# EAGLE design Satshakit_Crab (EAGLE 8.0.1)
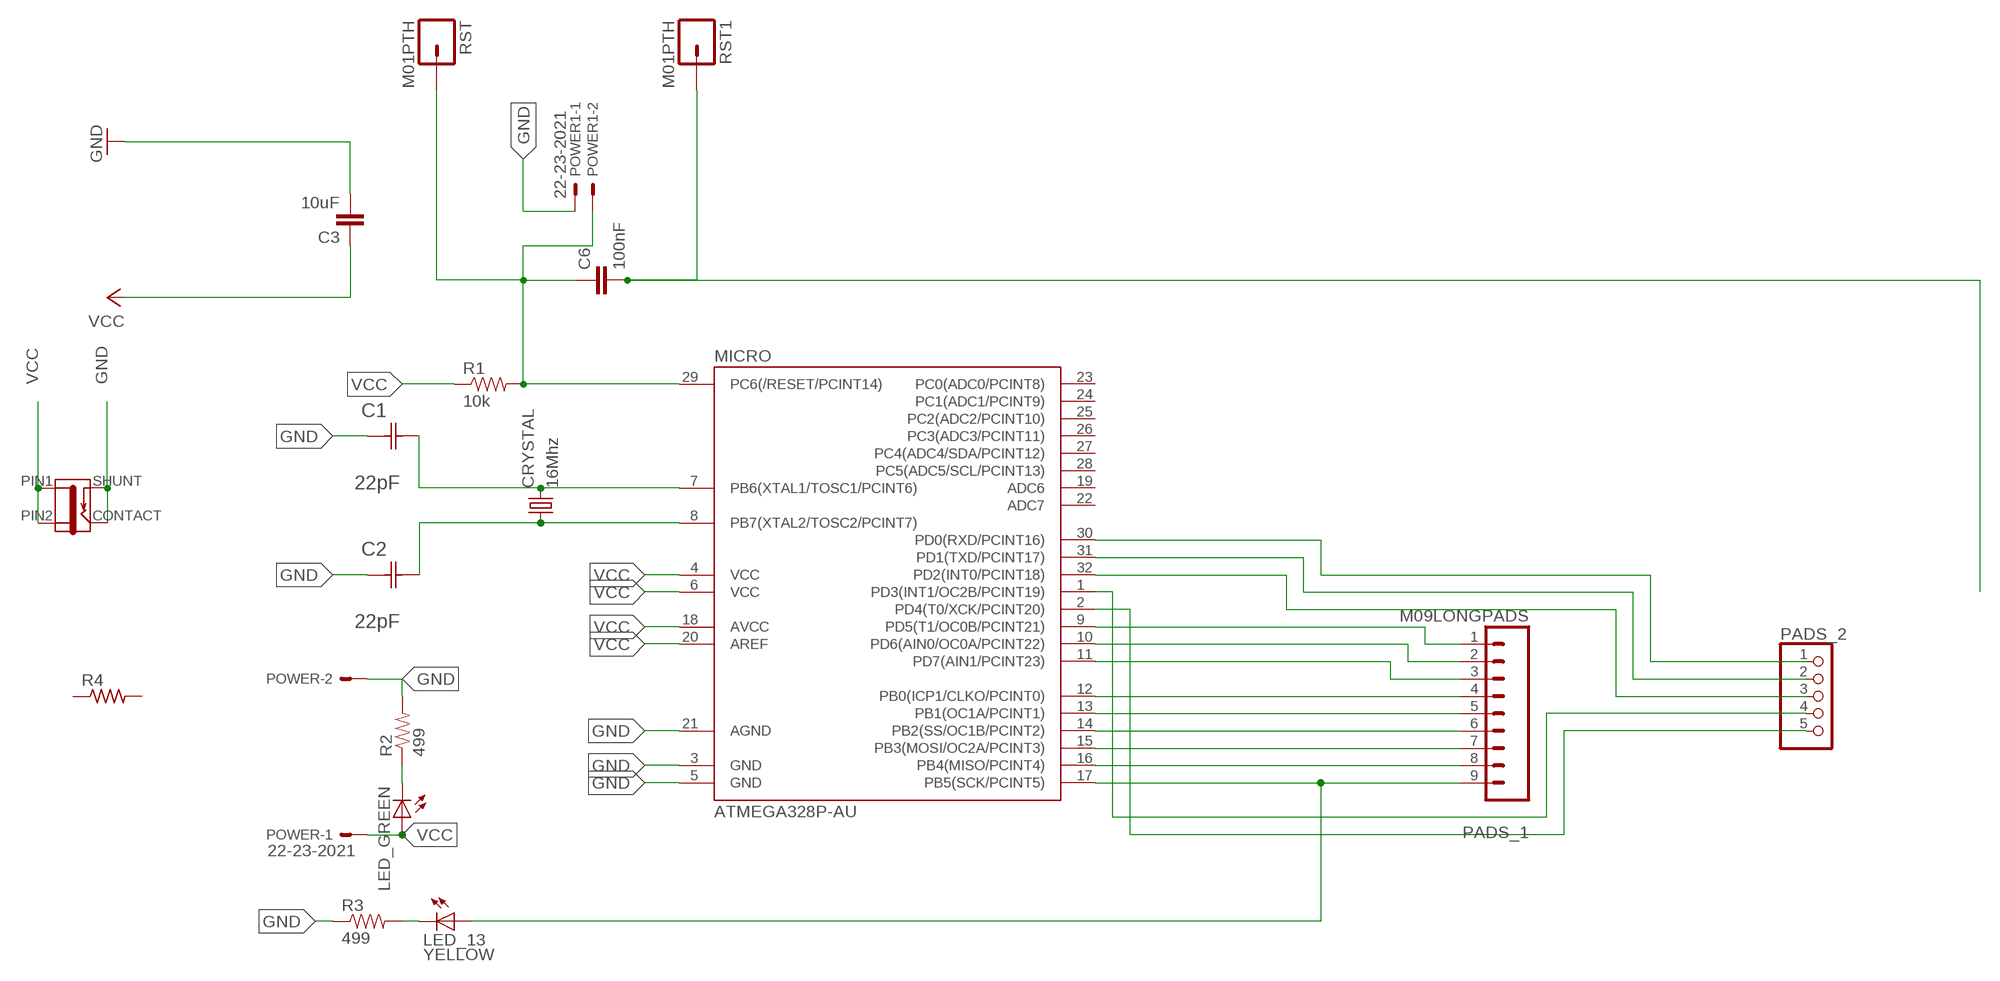
[diagram p0: schematic, sheet 1]

## Parts
C1  22pF  0612ZC225MAT2A  [CAPC3216X178N]
C2  22pF  0612ZC225MAT2A  [CAPC3216X178N]
C3  10uF  CAP1206  [1206]
C6  100nF  CAP1206  [1206]
CRYSTAL  16Mhz  CSM-7X-DU  [CSM-7X-DU]
J1  JACK-2.1MM  [PJ-002AH-SMT]
LED_13  YELLOW  LED1206  [1206]
LED_GREEN  LED1206  [1206]
MICRO  ATMEGA328P-AU  ATMEGA48/88/168-AU  [TQFP32-08]
PADS_1  M09LONGPADS  [1X09_LONGPADS]
PADS_2  PINHD-1X5  [1X05]
POWER  22-23-2021  [22-23-2021]
POWER1  22-23-2021  [22-23-2021]
R1  10k  RESISTOR1206  [1206]
R2  499  RESISTOR1206  [1206]
R3  499  RESISTOR1206  [1206]
R4  RES-US1206FAB  [R1206FAB]
RST  M01PTH  [1X01]
RST1  M01PTH  [1X01]

## Nets
GND: C1.1(C1) C2.1(C1) C3.2 J1.CONTACT J1.SHUNT MICRO.3(GND) MICRO.5(GND) MICRO.21(AGND) POWER1.1 POWER.2 R2.2 R3.1
N$1: MICRO.9(PD5(T1/OC0B/PCINT21)) PADS_1.1
N$2: C1.2(C2) CRYSTAL.2 MICRO.7(PB6(XTAL1/TOSC1/PCINT6))
N$3: C6.2 RST1.1
N$4: MICRO.10(PD6(AIN0/OC0A/PCINT22)) PADS_1.2
N$5: MICRO.11(PD7(AIN1/PCINT23)) PADS_1.3
N$6: MICRO.12(PB0(ICP1/CLKO/PCINT0)) PADS_1.4
N$7: MICRO.13(PB1(OC1A/PCINT1)) PADS_1.5
N$8: MICRO.14(PB2(SS/OC1B/PCINT2)) PADS_1.6
N$9: C2.2(C2) CRYSTAL.1 MICRO.8(PB7(XTAL2/TOSC2/PCINT7))
N$10: MICRO.15(PB3(MOSI/OC2A/PCINT3)) PADS_1.7
N$11: MICRO.16(PB4(MISO/PCINT4)) PADS_1.8
N$12: LED_13.1(A) MICRO.17(PB5(SCK/PCINT5)) PADS_1.9
N$20: MICRO.30(PD0(RXD/PCINT16)) PADS_2.1
N$21: MICRO.31(PD1(TXD/PCINT17)) PADS_2.2
N$22: MICRO.32(PD2(INT0/PCINT18)) PADS_2.3
N$23: MICRO.1(PD3(INT1/OC2B/PCINT19)) PADS_2.4
N$24: MICRO.2(PD4(T0/XCK/PCINT20)) PADS_2.5
N$26: LED_GREEN.2(C) R2.1
N$27: LED_13.2(C) R3.2
N$28: C6.1 MICRO.29(PC6(/RESET/PCINT14)) POWER1.2 R1.2 RST.1
VCC: C3.1 J1.PIN1 J1.PIN2 LED_GREEN.1(A) MICRO.4(VCC) MICRO.6(VCC) MICRO.18(AVCC) MICRO.20(AREF) POWER.1 R1.1
Unconnected: MICRO.19(ADC6) MICRO.22(ADC7) MICRO.23(PC0(ADC0/PCINT8)) MICRO.24(PC1(ADC1/PCINT9)) MICRO.25(PC2(ADC2/PCINT10)) MICRO.26(PC3(ADC3/PCINT11)) MICRO.27(PC4(ADC4/SDA/PCINT12)) MICRO.28(PC5(ADC5/SCL/PCINT13)) R4.1 R4.2

## Library data of the parts
C1 C2 = AVX_By_element14_Batch_1:0612ZC225MAT2A: Capacitor 1206; MPN: 0612ZC225MAT2A; OC_FARNELL: -; OC_NEWARK: 12N3209; SUPPLIER: AVX; TOLERANCE: ±20%; VALUE: 2.2µF; VOLTAGERATING: 10V
C3 C6 = 01_SparkFun:CAP: Capacitor Standard 0603 ceramic capacitor, and 0.1" leaded capacitor.
CRYSTAL = 01_FAB_Hello:CSM-7X-DU: SMD CRYSTAL Source: www.ecsxtal.com .. Crystal 3.6864MHz CSM_7X_DU.PDF; OC_FARNELL: unknown; OC_NEWARK: unknown
J1 = fab:JACK-2.1MM: SMD DC power jack PJ-002AH-SMT As found in the fablab inventory. Made by Zaerc.
LED_13 LED_GREEN = 01_FAB_Hello:LED
MICRO = atmega8:ATMEGA48/88/168
PADS_1 = 01_SparkFun:M09: Header 9 Standard 9-pin 0.1" header. Use with straight break away headers (SKU : PRT-00116), right angle break away headers (PRT-00553), swiss pins (PRT-00743), machine pins (PRT-00117), and female headers (PRT-00115).
PADS_2 = pinhead:PINHD-1X5: PIN HEADER
POWER POWER1 = con-molex:22-23-2021: .100" (2.54mm) Center Header - 2 Pin; MF: MOLEX; MPN: 22-23-2021; OC_FARNELL: 1462926; OC_NEWARK: 25C3832
R1-R3 = 01_SparkFun:RESISTOR: Resistor Basic schematic elements and footprints for 0603, 1206, and PTH 1/10th watt (small) resistors.
R4 = fab:RES-US: Resistor (US Symbol) Variants with postfix FAB are widened to allow the routing of internal traces
RST RST1 = 01_SparkFun:M01: Header 1 Standard 1-pin 0.1" header. Use with straight break away headers (SKU : PRT-00116), right angle break away headers (PRT-00553), swiss pins (PRT-00743), machine pins (PRT-00117), and female headers (PRT-00115).

## Board
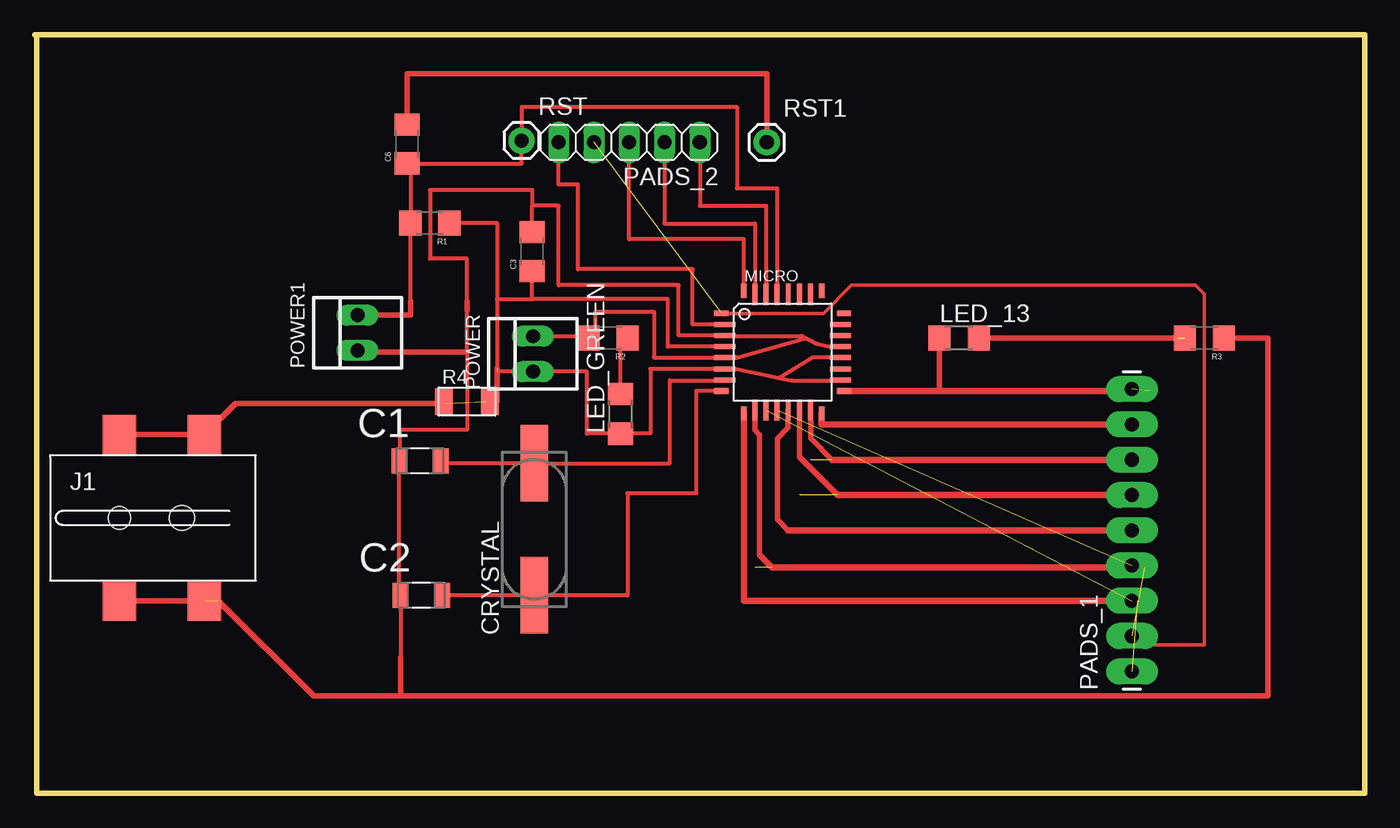
[diagram p1: board, top side]

Size 95.76 x 54.61 mm. Coordinates in mm from the lower left corner, seen from the top.
Outline: 0.13,54.61 0.13,0 95.76,0 95.76,54.61 0,54.61
Copper layers (1*16): Top 0.035mm / dielectric 1.5mm / Bottom 0.035mm
Design rules "default *": minimum track width 12mil, minimum drill 24mil, track to track 16mil, track to pad 16mil, pad to pad 16mil, via to via 16mil, smd to smd 16mil, copper to edge 40mil, drill to drill 8mil, minimum pad ring 10mil, minimum via ring 8mil, stop-mask expansion 4mil, vias tented up to drill 0mil, thermal gap 10mil

### Footprints (pad centres in the part's own frame; a part is rotated, then mirrored left to right if it is on the bottom)
CAPC3216X178N = smd 1.118 x 1.803: 1 -1.499,0; 2 1.499,0
1206 = smd 1.6 x 1.8: 1 -1.4,0; 2 1.4,0
CSM-7X-DU = smd 5.5 x 2: 1 -4.75,0; 2 4.75,0
PJ-002AH-SMT = smd 2.4 x 2.8: CONTACT -2.4,-6; PIN1 3.7,6; PIN2 -2.4,6; SHUNT 3.7,-6 | hole 1.6: -2.4,0 | hole 1.8: 2.1,0
1206' = smd 1.6 x 1.803: 1 -1.422,0; 2 1.422,0
TQFP32-08 = smd 1.016 x 0.406: 1 -4.42,2.8; 8 -4.42,-2.8; 17 4.42,-2.8; 24 4.42,2.8 | smd 1.524 x 0.356: 2 -4.166,2; 3 -4.166,1.2; 4 -4.166,0.4; 5 -4.166,-0.4; 6 -4.166,-1.2; 7 -4.166,-2; 18 4.166,-2; 19 4.166,-1.2; 20 4.166,-0.4; 21 4.166,0.4; 22 4.166,1.2; 23 4.166,2 | smd 0.406 x 1.016: 9 -2.8,-4.42; 16 2.8,-4.42; 25 2.8,4.42; 32 -2.8,4.42 | smd 0.356 x 1.524: 10 -2,-4.166; 11 -1.2,-4.166; 12 -0.4,-4.166; 13 0.4,-4.166; 14 1.2,-4.166; 15 2,-4.166; 26 2,4.166; 27 1.2,4.166; 28 0.4,4.166; 29 -0.4,4.166; 30 -1.2,4.166; 31 -2,4.166
1X09_LONGPADS = drill 1.016 pad 1.88 long: 1 0,0; 2 2.54,0; 3 5.08,0; 4 7.62,0; 5 10.16,0; 6 12.7,0; 7 15.24,0; 8 17.78,0; 9 20.32,0
1X05 = drill 1.016 long: 1 -5.08,0; 2 -2.54,0; 3 0,0; 4 2.54,0; 5 5.08,0
22-23-2021 = drill 1 long: 1 -1.27,0; 2 1.27,0
R1206FAB = smd 1.27 x 1.905: 1 -1.651,0; 2 1.651,0
1X01 = drill 1.016 pad 1.88: 1 0,0

### Placement (x,y rotation side)
C1  27.74,23.93 0 top
C2  27.84,14.25 0 top
C3  35.81,38.99 90 top
C6  26.8,46.74 90 top
CRYSTAL  35.97,19 90 top
J1  8.51,19.81 0 top
LED_13  YELLOW  [1206']  66.55,32.77 0 top
LED_GREEN  [1206']  42.16,27.3 90 top
MICRO  53.85,31.75 0 top
PADS_1  78.99,8.76 90 top
PADS_2  42.8,46.86 180 top
POWER  35.86,31.62 90 top
POWER1  23.24,33.15 90 top
R1  28.45,41.05 180 top
R2  41.27,32.77 180 top
R3  84.2,32.77 180 top
R4  31.12,28.19 0 top
RST  35.05,46.99 0 top
RST1  52.7,46.86 0 top

### Tracks (layer width: path | path; a pad name or v marks a point on that pad's centre or on a via)
GND  (1 unrouted)
  Top 0.305: MICRO.5 | MICRO.21 57.4,32.13 56.26,32.38 55.24,32.92 | C1.1 26.24,14.25 C2.1 26.34,9.78 | C1.1 26.16,23.93 | MICRO.5 49.68,31.37 44.58,31.37 44.58,34.67 40.39,34.67 40.39,32.64 40.38,32.64 R2.2 40.38,32.89 POWER.2 | C1.1 26.29,23.93 26.29,26.16 31.12,26.16 31.12,31.75 31.12,34.8 31.09,34.8 | MICRO.5 50.29,31.37 50.55,31.37 55.42,32.72 | 35.81,42.29 37.72,42.29 37.72,36.58 46.35,36.58 46.35,32.95 MICRO.3 49.71,32.92 55.24,32.92 | 55.42,32.72 55.56,32.75 | 55.24,32.92 55.42,32.72 | C3.2 35.81,42.29 | 31.12,35.43 31.12,38.48 28.45,38.48 28.45,43.43 35.81,43.43 35.81,42.29
  Top 0.406: 26.34,6.98 26.34,9.78 | 26.34,6.98 88.77,6.98 88.77,32.77 R3.1 | J1.CONTACT 6.11,13.84 13.21,13.84 20.07,6.98 26.34,6.98 | 31.12,34.8 31.12,35.43 | POWER1.1 23.24,31.75 31.12,31.75
N$1  (1 unrouted)
  Top 0.457: MICRO.9 51.05,13.84 79.38,13.84
N$2
  Top 0.305: 29.23,23.75 C1.2 29.23,23.75 | MICRO.7 49.68,29.72 45.72,29.72 45.72,23.75 CRYSTAL.2 29.23,23.75
N$3
  Top 0.406: C6.2 26.8,51.82 52.7,51.82 RST1.1
N$4  (2 unrouted)
  Top 0.406: MICRO.10 51.85,26.13 52.2,25.78 52.2,17.14 53.09,16.26
  Top 0.457: 53.09,16.26 79.88,16.26
N$5  (1 unrouted)
N$6  (1 unrouted)
  Top 0.305: MICRO.12 53.47,27.58
N$7
  Top 0.406: MICRO.13 54.25,26.31 53.47,25.53 53.47,19.7 54.25,18.92
  Top 0.457: 54.25,18.92 PADS_1.5
N$8  (1 unrouted)
  Top 0.406: MICRO.14 55.05,24.2 57.78,21.46
  Top 0.457: 57.78,21.46 PADS_1.6
N$9
  Top 0.305: 29.34,14.22 C2.2 | MICRO.8 47.62,28.96 47.62,21.59 42.67,21.59 42.67,14.22 35.97,14.22 CRYSTAL.1 C2.2 | C2.2
N$10  (1 unrouted)
  Top 0.305: MICRO.15 55.88,26.8
  Top 0.406: 55.88,26.8 55.88,25.53 57.4,24
  Top 0.457: 57.4,24 PADS_1.7
N$11
  Top 0.305: MICRO.16
  Top 0.457: MICRO.16 56.65,26.54 PADS_1.8
N$12  (1 unrouted)
  Top 0.406: LED_13.1 65.13,28.96 64.52,28.96
  Top 0.457: MICRO.17 64.52,28.96 80.26,28.96
N$20
  Top 0.305: PADS_2.1 47.88,42.29 52.65,42.29 MICRO.30
N$21
  Top 0.305: PADS_2.2 45.34,41.02 51.85,41.02 MICRO.31
N$22
  Top 0.305: MICRO.32 51.05,39.88 42.8,39.88 PADS_2.3
N$23  (1 unrouted)
  Top 0.254: MICRO.1 56.77,34.54 58.8,36.58 83.57,36.58 84.2,35.94 84.2,10.67 78.99,10.67
N$24
  Top 0.305: MICRO.2 47.37,33.75 47.37,37.72 39.12,37.72 39.12,43.81 37.72,43.81 PADS_2.5
N$26
  Top 0.305: 43.05,32.51 R2.1 42.67,32.38 42.16,32.38 LED_GREEN.2
N$27  (1 unrouted)
  Top 0.406: LED_13.2 82.3,32.77
N$28
  Top 0.305: 53.47,35.92 MICRO.29 53.45,43.56 50.55,43.56 50.55,49.4 35.05,49.4 RST.1 35.05,45.34 27.05,45.34 | R1.2 26.79,41.05 | 27.05,35.43 R1.2 | C6.1 27.05,45.34 | 27.05,45.34 R1.2
  Top 0.406: POWER1.2 27.05,34.42 27.05,35.43
VCC  (2 unrouted)
  Top 0.305: MICRO.18 58.01,29.72 54.48,29.72 53.58,29.9 | MICRO.20 56.01,31.37 53.58,29.9 | MICRO.4 45.59,32.15 45.59,35.56 35.81,35.56 | 33.27,35.56 33.27,41.05 R1.1 | 33.27,35.56 33.27,30.35 POWER.1 39.75,30.35 39.75,25.88 LED_GREEN.1 42.16,25.91 44.32,25.91 44.32,30.55 MICRO.6 50.37,30.56 52.82,30.06 53.58,29.9 | 33.27,35.56 35.81,35.56 | 35.81,35.56 C3.1 36.2,37.59 36.2,37.34
  Top 0.406: J1.PIN2 J1.PIN1 14.46,28.07 29.46,28.07 | 33.27,30.61 33.27,28.19 32.51,28.19